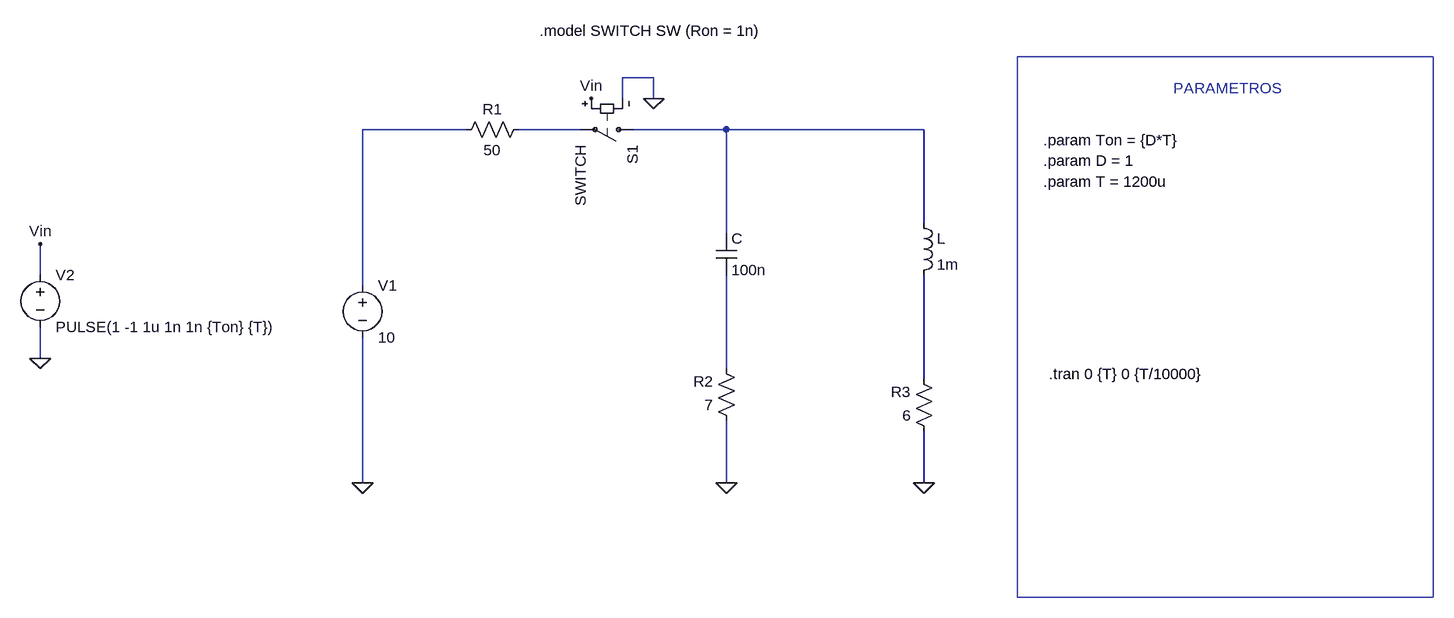
[diagram p0: schematic DescargaTransitorio.asc]
DescargaTransitorio.asc, the LTspice schematic file:
Version 4
SHEET 1 1076 680
WIRE -128 -144 -176 -144
WIRE -176 -112 -176 -144
WIRE -128 -112 -128 -144
WIRE -416 -64 -576 -64
WIRE -240 -64 -336 -64
WIRE -16 -64 -160 -64
WIRE 288 -64 -16 -64
WIRE 288 80 288 -64
WIRE -16 96 -16 -64
WIRE -1072 160 -1072 112
WIRE -576 176 -576 -64
WIRE -1072 288 -1072 240
WIRE -16 304 -16 160
WIRE 288 320 288 160
WIRE -576 480 -576 256
WIRE -16 480 -16 384
WIRE 288 480 288 400
FLAG -576 480 0
FLAG -16 480 0
FLAG 288 480 0
FLAG -1072 288 0
FLAG -1072 112 Vin
FLAG -224 -112 Vin
FLAG -128 -112 0
SYMBOL voltage -576 160 R0
WINDOW 123 0 0 Left 0
WINDOW 39 0 0 Left 0
SYMATTR InstName V1
SYMATTR Value 10
SYMBOL res -320 -80 R90
WINDOW 0 0 56 VBottom 2
WINDOW 3 32 56 VTop 2
SYMATTR InstName R1
SYMATTR Value 50
SYMBOL res 0 400 R180
WINDOW 0 36 76 Left 2
WINDOW 3 36 40 Left 2
SYMATTR InstName R2
SYMATTR Value 7
SYMBOL res 304 416 R180
WINDOW 0 36 76 Left 2
WINDOW 3 36 40 Left 2
SYMATTR InstName R3
SYMATTR Value 6
SYMBOL cap -32 96 R0
SYMATTR InstName C
SYMATTR Value 100n
SYMBOL ind 272 64 R0
SYMATTR InstName L
SYMATTR Value 1m
SYMBOL sw -144 -64 R90
SYMATTR InstName S1
SYMATTR Value SWITCH
SYMBOL voltage -1072 144 R0
WINDOW 123 0 0 Left 0
WINDOW 39 0 0 Left 0
SYMATTR InstName V2
SYMATTR Value PULSE(1 -1 1u 1n 1n {Ton} {T})
TEXT 672 -128 Left 2 ;PARAMETROS
TEXT 472 -48 Left 2 !.param Ton = {D*T}
TEXT 472 -16 Left 2 !.param D = 1
TEXT 472 16 Left 2 !.param T = 1200u
TEXT -304 -216 Left 2 !.model SWITCH SW (Ron = 1n)
TEXT 480 312 Left 2 !.tran 0 {T} 0 {T/10000}
RECTANGLE Normal 1072 656 432 -176

The netlist it stands for:
* DescargaTransitorio.asc
V1 N001 0 10
R1 N002 N001 50
R2 0 N004 7
R3 0 N005 6
C N003 N004 100n
L N003 N005 1m
S1 N003 N002 Vin 0 SWITCH
V2 Vin 0 PULSE(1 -1 1u 1n 1n {Ton} {T})
* PARAMETROS
.param Ton = {D*T}
.param D = 1
.param T = 1200u
.model SWITCH SW (Ron = 1n)
.tran 0 {T} 0 {T/10000}
.backanno
.end